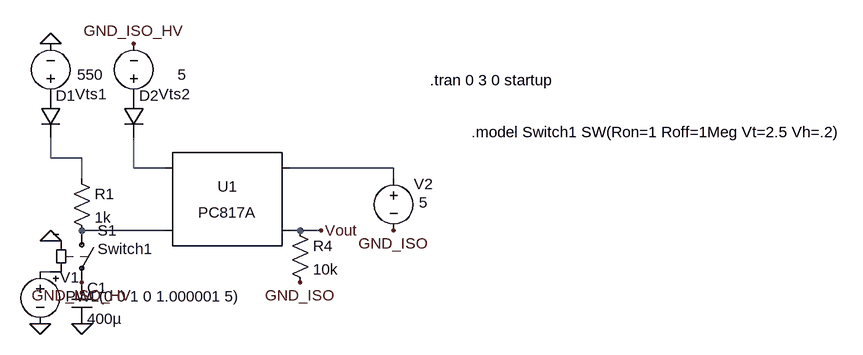
[diagram p0: schematic precharge.asc]
precharge.asc, the LTspice schematic file:
Version 4
SHEET 1 1344 808
WIRE 112 320 112 288
WIRE 160 320 112 320
WIRE 240 336 240 288
WIRE 288 336 240 336
WIRE 640 336 480 336
WIRE 160 352 160 320
WIRE 640 352 640 336
WIRE 288 432 160 432
WIRE 496 432 480 432
WIRE 528 432 496 432
WIRE 112 496 96 496
FLAG 496 512 GND_ISO
FLAG 640 432 GND_ISO
FLAG 528 432 Vout
FLAG 240 144 GND_ISO_HV
FLAG 112 144 0
FLAG 160 576 0
FLAG 160 512 GND_ISO_HV
FLAG 112 448 0
FLAG 96 576 0
SYMBOL Optos\\PC817A 384 384 R0
SYMATTR InstName U1
SYMBOL res 480 416 R0
SYMATTR InstName R4
SYMATTR Value 10k
SYMBOL voltage 640 336 R0
WINDOW 0 31 24 Left 2
WINDOW 3 39 53 Left 2
WINDOW 123 0 0 Left 0
WINDOW 39 0 0 Left 0
SYMATTR InstName V2
SYMATTR Value 5
SYMBOL voltage 112 240 R180
WINDOW 0 -86 18 Left 2
WINDOW 3 -81 48 Left 2
WINDOW 123 0 0 Left 0
SYMATTR InstName Vts1
SYMATTR Value 550
SYMATTR SpiceLine Rser=100
SYMBOL voltage 240 240 R180
WINDOW 0 -86 18 Left 2
WINDOW 3 -81 48 Left 2
WINDOW 123 0 0 Left 0
SYMATTR InstName Vts2
SYMATTR Value 5
SYMATTR SpiceLine Rser=1m
SYMBOL diode 224 224 R0
WINDOW 3 24 64 Invisible 2
SYMATTR InstName D2
SYMATTR Value RFU02VS8S
SYMBOL cap 144 512 R0
SYMATTR InstName C1
SYMATTR Value 400µ
SYMBOL sw 160 416 R0
WINDOW 3 24 44 Left 2
SYMATTR Value Switch1
SYMATTR InstName S1
SYMBOL voltage 96 480 R0
WINDOW 0 31 24 Left 2
WINDOW 3 39 53 Left 2
WINDOW 123 0 0 Left 0
WINDOW 39 0 0 Left 0
SYMATTR InstName V1
SYMATTR Value PWL(0 0 1 0 1.000001 5)
SYMBOL diode 96 224 R0
WINDOW 3 24 64 Invisible 2
SYMATTR InstName D1
SYMATTR Value RFN10NS8D
SYMBOL res 144 336 R0
SYMATTR InstName R1
SYMATTR Value 1k
TEXT 696 200 Left 2 !.tran 0 3 0 startup
TEXT 760 280 Left 2 !.model Switch1 SW(Ron=1 Roff=1Meg Vt=2.5 Vh=.2)

The netlist it stands for:
* precharge.asc
XU1 N002 N004 N003 Vout PC817 Igain=1m
R4 Vout GND_ISO 10k
V2 N003 GND_ISO 5
Vts1 P001 0 550 Rser=100
Vts2 P002 GND_ISO_HV 5 Rser=1m
D2 P002 N002 RFU02VS8S
C1 GND_ISO_HV 0 400µ
S1 N004 GND_ISO_HV N005 0 Switch1
V1 N005 0 PWL(0 0 1 0 1.000001 5)
D1 P001 N001 RFN10NS8D
R1 N001 N004 1k
.model D D
.lib standard.dio
.tran 0 3 0 startup
.model Switch1 SW(Ron=1 Roff=1Meg Vt=2.5 Vh=.2)
.lib PC817.sub
.backanno
.end